# Altium schematic sheet SurfaceMountTeensy.SchDoc
size A
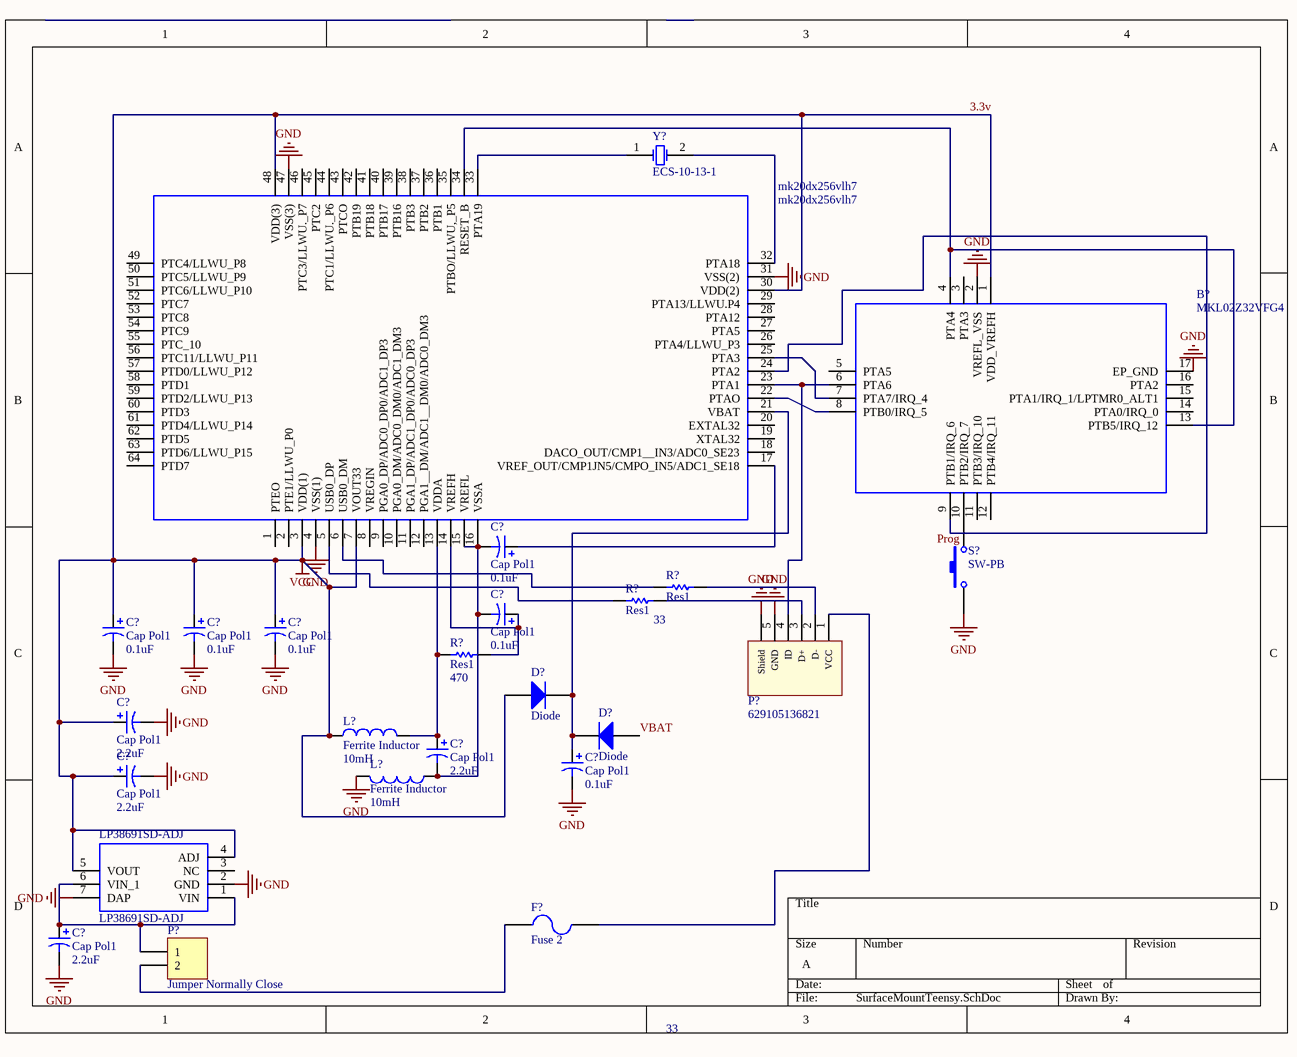
[diagram p0: SurfaceMountTeensy.SchDoc]

## Parts
(Parts that share a designator on the sheet are numbered #1, #2 ... from top to bottom, then left to right.)
B?  MKL02Z32VFG4  [QFN50P300X300X65-17N-D]
C?#1  Cap Pol1  value 0.1uF  [RB7.6-15]
C?#2  Cap Pol1  value 0.1uF  [RB7.6-15]
C?#3  Cap Pol1  value 0.1uF  [RB7.6-15]
C?#4  Cap Pol1  value 0.1uF  [RB7.6-15]
C?#5  Cap Pol1  value 0.1uF  [RB7.6-15]
C?#6  Cap Pol1  value 2.2uF  [RB7.6-15]
C?#7  Cap Pol1  value 2.2uF  [RB7.6-15]
C?#8  Cap Pol1  value 2.2uF  [RB7.6-15]
C?#9  Cap Pol1  value 0.1uF  [RB7.6-15]
C?#10  Cap Pol1  value 2.2uF  [RB7.6-15]
D?#1  Diode  [SMC]
D?#2  Diode  [SMC]
F?  Fuse 2  [PIN-W2/E2.8]
L?#1  Ferrite Inductor  value 10mH  [0402-A]
L?#2  Ferrite Inductor  value 10mH  [0402-A]
LP38691SD-ADJ  LP38691SD-ADJ  [SON95P300X300X80-7N]
mk20dx256vlh7  mk20dx256vlh7  [QFP50P1200X1200X160-64N]
P?#1  629105136821  [629105136821]
P?#2  Jumper Normally Close  [HDR1X2]
R?#1  Res1  value 33  [AXIAL-0.3]
R?#2  Res1  value 33  [AXIAL-0.3]
R?#3  Res1  value 470  [AXIAL-0.3]
S?  SW-PB  [SPST-2]
Y?  ECS-10-13-1  [HC-49U]

## Nets
3.3v: B?.1(VDD_VREFH) C?#2.1 C?#3.1 C?#4.1 C?#6.1 C?#8.1 D?#1.1(A) L?#1.1 LP38691SD-ADJ.4(ADJ) LP38691SD-ADJ.5(VOUT) mk20dx256vlh7.3(VDD(1)) mk20dx256vlh7.7(VOUT33) mk20dx256vlh7.30(VDD(2)) mk20dx256vlh7.48(VDD(3))  [also labelled VCC]
GND: B?.2(VREFL_VSS) B?.17(EP_GND) C?#2.2 C?#3.2 C?#4.2 C?#6.2 C?#8.2 C?#9.2 C?#10.2 L?#2.2 LP38691SD-ADJ.2(GND) LP38691SD-ADJ.7(DAP) mk20dx256vlh7.4(VSS(1)) mk20dx256vlh7.31(VSS(2)) mk20dx256vlh7.47(VSS(3)) P?#1.5(GND) P?#1.Shell(Shield) S?.1
VBAT: D?#2.1(A)
NetB?_4: B?.4(PTA4) B?.13(PTB5/IRQ_12) mk20dx256vlh7.34(RESET_B)
NetB?_6: B?.6(PTA6) mk20dx256vlh7.23(PTA1) P?#1.4(ID)
NetB?_7: B?.7(PTA7/IRQ_4) mk20dx256vlh7.25(PTA3)
NetB?_8: B?.8(PTB0/IRQ_5) mk20dx256vlh7.22(PTAO)
NetB?_9: B?.9(PTB1/IRQ_6) mk20dx256vlh7.24(PTA2)
NetB?_10: B?.10(PTB2/IRQ_7) S?.2
NetC?#1_1: C?#1.1 mk20dx256vlh7.17(VREF_OUT/CMP1JN5/CMPO_IN5/ADC1_SE18)
NetC?#1_2: C?#1.2 C?#5.2 C?#7.2 L?#2.1 mk20dx256vlh7.15(VREFL) mk20dx256vlh7.16(VSSA)
NetC?#5_1: C?#5.1 mk20dx256vlh7.14(VREFH) R?#3.1
NetC?#7_1: C?#7.1 L?#1.2 mk20dx256vlh7.13(VDDA) R?#3.2
NetC?#9_1: C?#9.1 D?#1.2(K) D?#2.2(K) mk20dx256vlh7.21(VBAT)
NetC?#10_1: C?#10.1 LP38691SD-ADJ.1(VIN) LP38691SD-ADJ.6(VIN_1) P?#2.1
NetF?_1: F?.1 P?#2.2
NetF?_2: F?.2 P?#1.1(VCC)
Netmk20dx256vlh7_5: mk20dx256vlh7.5(USB0_DP) R?#2.2
Netmk20dx256vlh7_6: mk20dx256vlh7.6(USB0_DM) R?#1.2
Netmk20dx256vlh7_32: mk20dx256vlh7.32(PTA18) Y?.2(OSC2)
Netmk20dx256vlh7_33: mk20dx256vlh7.33(PTA19) Y?.1(OSC1)
NetP?#1_2: P?#1.2(D-) R?#1.1
NetP?#1_3: P?#1.3(D+) R?#2.1

Not connected (* = marked no-connect by the designer): B? 3(PTA3) 5(PTA5) 11(PTB3/IRQ_10) 12(PTB4/IRQ_11) 14(PTA0/IRQ_0) 15(PTA1/IRQ_1/LPTMR0_ALT1) 16(PTA2); LP38691SD-ADJ 3(NC); mk20dx256vlh7 1(PTEO) 2(PTE1/LLWU_P0) 8(VREGIN) 9(PGA0_DP/ADC0_DP0/ADC1_DP3) 10(PGA0_DM/ADC0_DM0/ADC1_DM3) 11(PGA1_DP/ADC1_DP0/ADC0_DP3) 12(PGA1__DM/ADC1__DM0/ADC0_DM3) 18(DACO_OUT/CMP1__IN3/ADC0_SE23) 19(XTAL32) 20(EXTAL32) 26(PTA4/LLWU_P3) 27(PTA5) 28(PTA12) 29(PTA13/LLWU.P4) 35(PTBO/LLWU,_P5) 36(PTB1) 37(PTB2) 38(PTB3) 39(PTB16) 40(PTB17) 41(PTB18) 42(PTB19) 43(PTCO) 44(PTC1/LLWU._P6) 45(PTC2) 46(PTC3/LLWU._P7) 49(PTC4/LLWU_P8) 50(PTC5/LLWU_P9) 51(PTC6/LLWU_P10) 52(PTC7) 53(PTC8) 54(PTC9) 55(PTC_10) 56(PTC11/LLWU_P11) 57(PTD0/LLWU_P12) 58(PTD1) 59(PTD2/LLWU_P13) 60(PTD3) 61(PTD4/LLWU_P14) 62(PTD5) 63(PTD6/LLWU_P15) 64(PTD7)

## Notes on the sheet
- Labels drawn without touching a wire or pin: Prog

## Library data of the parts
B? = MKL02Z32VFG4: Freescale MKL02Z32VFG4, 32bit ARM Cortex M0 Microcontroller, 48MHz, 32 kB Flash, 16-Pin QFN; Manufacturer_Name: Nexperia; Geometry.Height: 0.65mm; Supplier_Name: RS; RS Part Number: 7884723; Manufacturer_Part_Number: MKL02Z32VFG4; Allied_Number: *; Other Part Number: *; Datasheet Link: http://cache.nxp.com/files/32bit/doc/data_sheet/KL02P32M48SF0.pdf; 3D Package: *
C?#1-C?#10 = Cap Pol1: Polarized Capacitor (Radial); Published: 8-Jun-2000; LatestRevisionDate: 17-Jul-2002; LatestRevisionNote: Re-released for DXP Platform.; PackageReference: RB7.6-15; Publisher: Altium Limited; PackageDescription: Polarized Capacitor (Radial); 2 Leads
D?#1 D?#2 = Diode: Default Diode; Published: 8-Jun-2000; LatestRevisionDate: 17-Jul-2002; LatestRevisionNote: Re-released for DXP Platform.; PackageVersion: Sep-1996; PackageReference: SMC; Publisher: Altium Limited; PackageDescription: DO-214-AB/SMC; 2 C-Bend Leads; Body 7.9 x 5.9 mm, inc. leads (LxW); Code_JEDEC: DO-214-AB
F? = Fuse 2: Fuse; Published: 8-Jun-2000; LatestRevisionDate: 17-Jul-2002; LatestRevisionNote: Re-released for DXP Platform.; PackageReference: PIN-W2/E2.8; Publisher: Altium Limited; PackageDescription: Thru-Hole; 2 Leads
L?#1 L?#2 = Inductor: Code_IEC: 1005; Published: 8-Jun-2000; LatestRevisionDate: 29-May-2009; LatestRevisionNote: IPC-7351 Footprint Added.; PackageReference: 0402-A; Publisher: Altium Limited; PackageDescription: Chip Inductor; Code_JEITA: 0402
LP38691SD-ADJ = LP38691SD-ADJ: 500mA LDO Regulator Adj.,LP38691SD-ADJ; Manufacturer_Name: Texas Instruments; Geometry.Height: 0.8mm; Supplier_Name: Mouser; Mouser Part Number: 926-LP38691SD-ADJ; Manufacturer_Part_Number: LP38691SD-ADJ; Datasheet Link: http://www.ti.com/lit/ds/symlink/lp38691-adj.pdf; 3D Package: *
mk20dx256vlh7 = mk20dx256vlh7: MK20DX256VLH7, ARM Cortex M4 MCU 72MHz 256 kB Flash, 64 kB RAM, USB CAN I2C 64-Pin LQFP; Manufacturer_Name: Nexperia; Geometry.Height: 1.6mm; Supplier_Name: RS; RS Part Number: 7862120P; Manufacturer_Part_Number: mk20dx256vlh7; Allied_Number: *; Other Part Number: *; Datasheet Link: https://www.pjrc.com/teensy/K20P64M72SF1.pdf; 3D Package: *
P?#1 = 629105136821: Micro USB 2.0 SMT Type B Horizontal 5 Contacts WR-COM; Interface Type: Type B; Gender: Receptacle; Publisher: Wurth Elektronik; ComponentLink1Description: Manufacturer; ComponentLink1URL: http://www.we-online.de; ComponentLink2Description: Datasheet; ComponentLink2URL: http://katalog.we-online.de/em/datasheet/629105136821.pdf; Part Number: 629105136821; Published Date: April 2017; Sub-Family: Micro USB 2.0; Type: Horizontal; Construction: SMT
P?#2 = Header 2: Header, 2-Pin; LatestRevisionDate: 17-Jul-2002; LatestRevisionNote: Re-released for DXP Platform.; Publisher: Altium Limited
R?#1-R?#3 = Res1: Resistor; Published: 8-Jun-2000; LatestRevisionDate: 17-Jul-2002; LatestRevisionNote: Re-released for DXP Platform.; PackageReference: AXIAL-0.3; Publisher: Altium Limited; PackageDescription: Axial Device, Thru-Hole; 2 Leads; 0.3 in Pin Spacing
S? = SW-PB: Switch; Published: 24-Mar-1999; LatestRevisionDate: 17-Jul-2002; LatestRevisionNote: Re-released for DXP Platform.; PackageReference: SPST-2; Publisher: Altium Limited; PackageDescription: Switch; 2 Leads
Y? = ECS-10-13-1: Crystal Oscillator; Published: 17-Jul-2002; DatasheetDocument: 18-Apr-2000; PackageReference: HC-49U; Publisher: Altium Limited; ComponentLink1Description: Manufacturer Link; ComponentLink1URL: http://www.ecsxtal.com/; ComponentLink2Description: Datasheet; ComponentLink2URL: http://www.ecsxtal.com/pdf2/HC49U.PDF